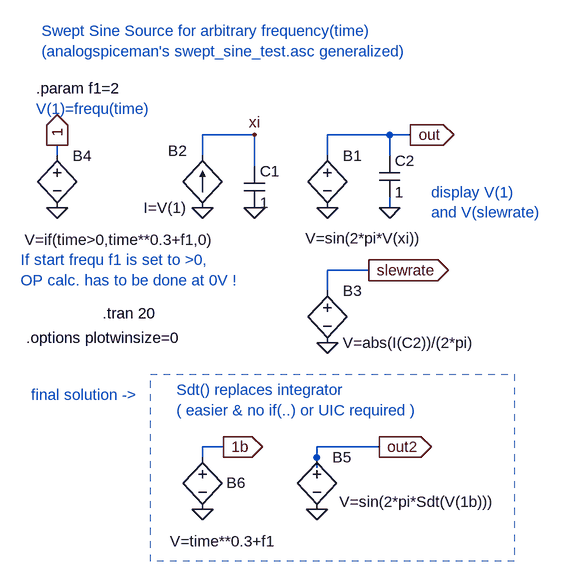
[diagram p0: schematic swept_sine_general.asc]
swept_sine_general.asc, the LTspice schematic file:
Version 4
SHEET 1 880 788
WIRE -336 160 -336 144
WIRE -112 160 -112 128
WIRE -112 624 -112 608
WIRE -80 608 -112 608
WIRE -32 128 -112 128
WIRE -32 176 -32 128
WIRE 64 624 64 608
WIRE 64 640 64 624
WIRE 80 160 80 128
WIRE 80 368 80 336
WIRE 144 336 80 336
WIRE 160 608 64 608
WIRE 176 128 80 128
WIRE 176 160 176 128
WIRE 176 240 176 224
WIRE 208 128 176 128
FLAG -32 240 0
FLAG -112 240 0
FLAG -32 128 xi
FLAG 80 240 0
FLAG 208 128 out
IOPIN 208 128 Out
FLAG 80 448 0
FLAG 176 240 0
FLAG -336 240 0
FLAG -336 144 1
IOPIN -336 144 Out
FLAG 144 336 slewrate
IOPIN 144 336 Out
FLAG 64 704 0
FLAG 160 608 out2
IOPIN 160 608 Out
FLAG -112 704 0
FLAG -80 608 1b
IOPIN -80 608 Out
SYMBOL bv 80 144 R0
WINDOW 3 -34 143 Left 0
SYMATTR Value V=sin(2*pi*V(xi))
SYMATTR InstName B1
SYMBOL bi -112 240 R180
WINDOW 0 24 88 Left 0
WINDOW 3 24 0 Left 0
SYMATTR InstName B2
SYMATTR Value I=V(1)
SYMBOL cap -48 176 R0
SYMATTR InstName C1
SYMATTR Value 1
SYMBOL bv 80 352 R0
SYMATTR InstName B3
SYMATTR Value V=abs(I(C2))/(2*pi)
SYMBOL cap 160 160 R0
SYMATTR InstName C2
SYMATTR Value 1
SYMBOL bv -336 144 R0
WINDOW 3 -50 145 Left 0
SYMATTR Value V=if(time>0,time**0.3+f1,0)
SYMATTR InstName B4
SYMBOL bv 64 608 R0
WINDOW 3 35 84 Left 0
SYMATTR Value V=sin(2*pi*Sdt(V(1b)))
SYMATTR InstName B5
SYMBOL bv -112 608 R0
WINDOW 3 -50 145 Left 0
WINDOW 0 37 55 Left 0
SYMATTR Value V=time**0.3+f1
SYMATTR InstName B6
TEXT -266 402 Left 0 !.tran 20
TEXT -384 440 Left 0 !.options plotwinsize=0
TEXT -368 88 Left 0 ;V(1)=frequ(time)
TEXT -360 -32 Left 0 ;Swept Sine Source for arbitrary frequency(time)\n(analogspiceman's swept_sine_test.asc generalized)
TEXT 240 216 Left 0 ;display V(1)\nand V(slewrate)
TEXT -152 520 Left 0 ;Sdt() replaces integrator\n( easier & no if(..) or UIC required )
TEXT -392 320 Left 0 ;If start frequ f1 is set to >0,\nOP calc. has to be done at 0V !
TEXT -368 56 Left 0 !.param f1=2
TEXT -376 528 Left 0 ;final solution ->
RECTANGLE Normal 368 784 -192 496 2

The netlist it stands for:
* swept_sine_general.asc
B1 out 0 V=sin(2*pi*V(xi))
B2 0 xi I=V(1)
C1 xi 0 1
B3 slewrate 0 V=abs(I(C2))/(2*pi)
C2 out 0 1
B4 1 0 V=if(time>0,time**0.3+f1,0)
B5 out2 0 V=sin(2*pi*Sdt(V(1b)))
B6 1b 0 V=time**0.3+f1
.tran 20
.options plotwinsize=0
* V(1)=frequ(time)
* Swept Sine Source for arbitrary frequency(time)
* (analogspiceman's swept_sine_test.asc generalized)
* display V(1)
* and V(slewrate)
* Sdt() replaces integrator
* ( easier & no if(..) or UIC required )
* If start frequ f1 is set to >0,
* OP calc. has to be done at 0V !
.param f1=2
* final solution ->
.backanno
.end